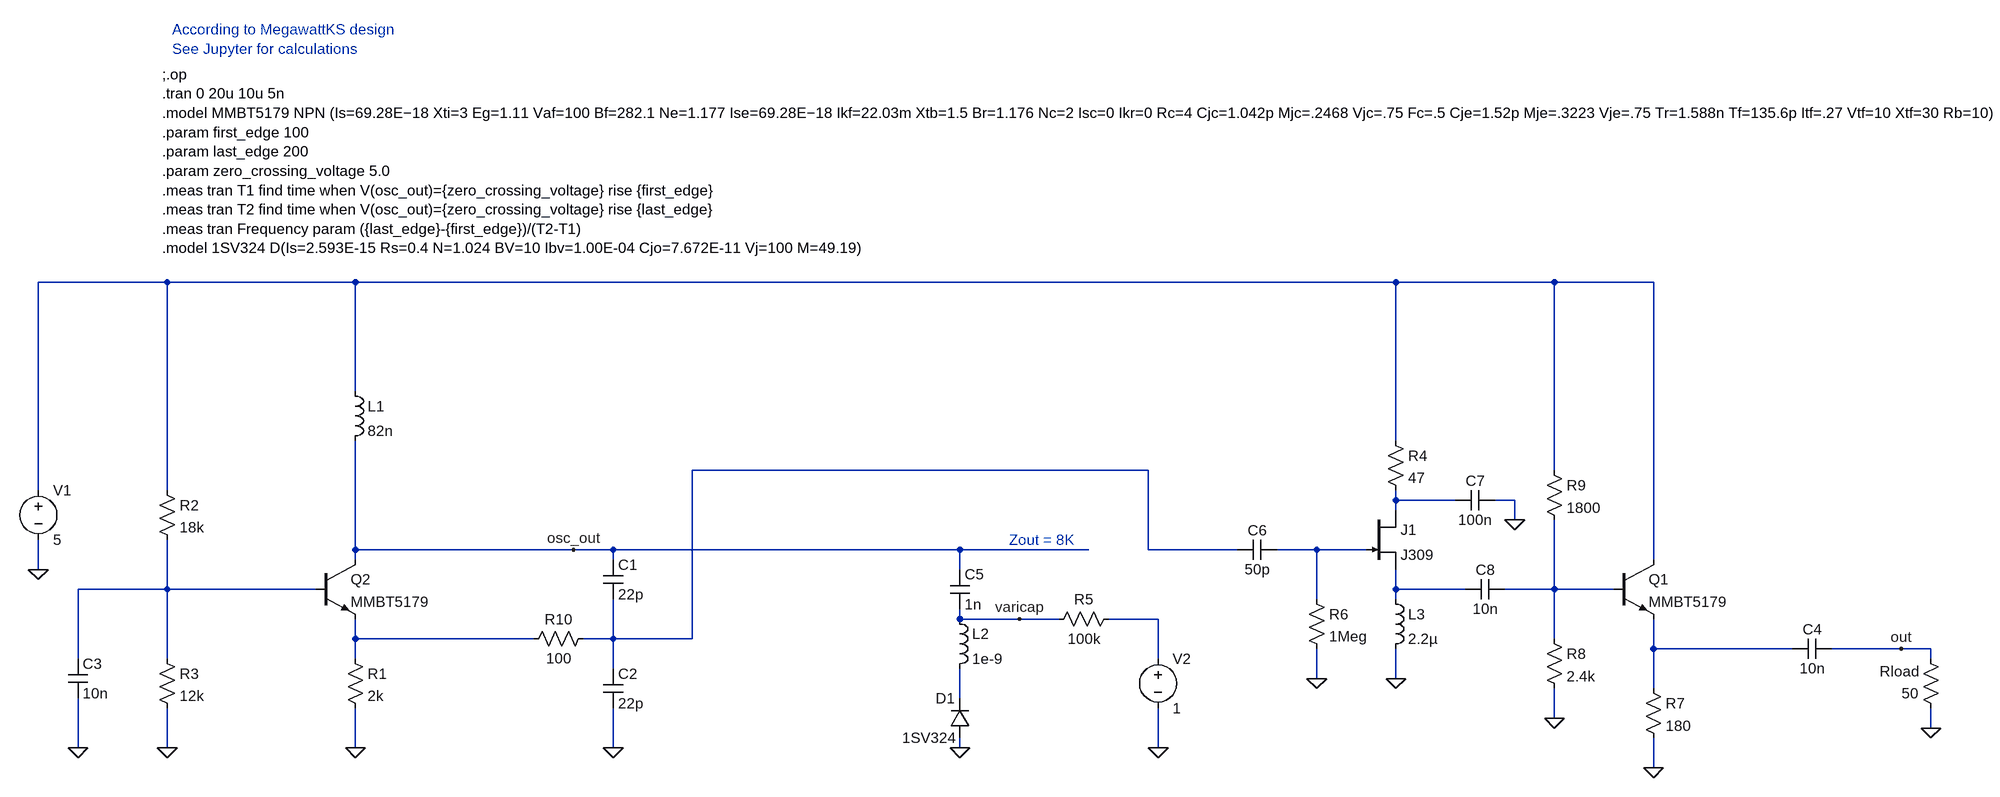
[diagram p0: schematic CB_Colpitts_JFET.asc]
CB_Colpitts_JFET.asc, the LTspice schematic file:
Version 4
SHEET 1 3300 1348
WIRE 48 -192 -160 -192
WIRE 352 -192 48 -192
WIRE 2032 -192 352 -192
WIRE 2288 -192 2032 -192
WIRE 2448 -192 2288 -192
WIRE 352 -16 352 -192
WIRE 2032 64 2032 -192
WIRE 1632 112 896 112
WIRE 2288 112 2288 -192
WIRE -160 144 -160 -192
WIRE 48 144 48 -192
WIRE 2032 160 2032 144
WIRE 2128 160 2032 160
WIRE 2224 160 2192 160
WIRE 2032 176 2032 160
WIRE 2224 192 2224 160
WIRE 352 240 352 64
WIRE 704 240 352 240
WIRE 768 240 704 240
WIRE 1328 240 768 240
WIRE 1536 240 1328 240
WIRE 1632 240 1632 112
WIRE 1776 240 1632 240
WIRE 1904 240 1840 240
WIRE 1984 240 1904 240
WIRE 352 256 352 240
WIRE 768 256 768 240
WIRE 2448 256 2448 -192
WIRE -160 272 -160 224
WIRE 1328 272 1328 240
WIRE 48 304 48 224
WIRE 48 304 -96 304
WIRE 288 304 48 304
WIRE 2032 304 2032 272
WIRE 2144 304 2032 304
WIRE 2288 304 2288 192
WIRE 2288 304 2208 304
WIRE 2384 304 2288 304
WIRE 1904 320 1904 240
WIRE 2032 320 2032 304
WIRE 1328 352 1328 336
WIRE 1424 352 1328 352
WIRE 1488 352 1424 352
WIRE 1648 352 1568 352
WIRE 352 384 352 352
WIRE 640 384 352 384
WIRE 768 384 768 320
WIRE 768 384 720 384
WIRE 896 384 896 112
WIRE 896 384 768 384
WIRE 2288 384 2288 304
WIRE 2448 400 2448 352
WIRE 2672 400 2448 400
WIRE 2848 400 2736 400
WIRE 2896 400 2848 400
WIRE -96 416 -96 304
WIRE 48 416 48 304
WIRE 352 416 352 384
WIRE 1648 416 1648 352
WIRE 2896 416 2896 400
WIRE 768 432 768 384
WIRE 1904 448 1904 400
WIRE 2032 448 2032 400
WIRE 2448 464 2448 400
WIRE 1328 480 1328 432
WIRE 2288 512 2288 464
WIRE 2896 528 2896 496
WIRE -96 560 -96 480
WIRE 48 560 48 496
WIRE 352 560 352 496
WIRE 768 560 768 496
WIRE 1328 560 1328 544
WIRE 1648 560 1648 496
WIRE 2448 592 2448 544
FLAG -160 272 0
FLAG 48 560 0
FLAG 352 560 0
FLAG 768 560 0
FLAG -96 560 0
FLAG 704 240 osc_out
FLAG 1648 560 0
FLAG 2896 528 0
FLAG 2848 400 out
FLAG 1328 560 0
FLAG 1424 352 varicap
FLAG 2224 192 0
FLAG 2032 448 0
FLAG 1904 448 0
FLAG 2448 592 0
FLAG 2288 512 0
DATAFLAG 144 304 ""
DATAFLAG 1216 240 ""
DATAFLAG 464 384 ""
DATAFLAG 1728 240 ""
SYMBOL npn 288 256 R0
SYMATTR InstName Q2
SYMATTR Value MMBT5179
SYMBOL res 336 400 R0
SYMATTR InstName R1
SYMATTR Value 2k
SYMBOL res 32 128 R0
SYMATTR InstName R2
SYMATTR Value 18k
SYMBOL res 32 400 R0
SYMATTR InstName R3
SYMATTR Value 12k
SYMBOL voltage -160 128 R0
SYMATTR InstName V1
SYMATTR Value 5
SYMBOL ind 336 -32 R0
SYMATTR InstName L1
SYMATTR Value 82n
SYMATTR SpiceLine Rser=0.01
SYMBOL cap 752 256 R0
SYMATTR InstName C1
SYMATTR Value 22p
SYMBOL cap 752 432 R0
SYMATTR InstName C2
SYMATTR Value 22p
SYMBOL cap -112 416 R0
SYMATTR InstName C3
SYMATTR Value 10n
SYMBOL res 1584 336 R90
WINDOW 0 0 56 VBottom 2
WINDOW 3 32 56 VTop 2
SYMATTR InstName R5
SYMATTR Value 100k
SYMBOL voltage 1648 400 R0
SYMATTR InstName V2
SYMATTR Value 1
SYMBOL diode 1344 544 R180
WINDOW 0 24 64 Left 2
WINDOW 3 24 0 Left 2
SYMATTR InstName D1
SYMATTR Value 1SV324
SYMBOL ind 1312 336 R0
SYMATTR InstName L2
SYMATTR Value 1e-9
SYMBOL res 2912 512 R180
WINDOW 0 36 76 Left 2
WINDOW 3 36 40 Left 2
SYMATTR InstName Rload
SYMATTR Value 50
SYMBOL cap 2736 384 R90
WINDOW 0 0 32 VBottom 2
WINDOW 3 32 32 VTop 2
SYMATTR InstName C4
SYMATTR Value 10n
SYMBOL res 736 368 R90
WINDOW 0 0 56 VBottom 2
WINDOW 3 32 56 VTop 2
SYMATTR InstName R10
SYMATTR Value 100
SYMBOL cap 1312 272 R0
SYMATTR InstName C5
SYMATTR Value 1n
SYMBOL njf 1984 176 R0
SYMATTR InstName J1
SYMATTR Value J309
SYMBOL res 2016 48 R0
SYMATTR InstName R4
SYMATTR Value 47
SYMBOL cap 2192 144 R90
WINDOW 0 0 32 VBottom 2
WINDOW 3 32 32 VTop 2
SYMATTR InstName C7
SYMATTR Value 100n
SYMBOL ind 2016 304 R0
SYMATTR InstName L3
SYMATTR Value 2.2µ
SYMBOL res 1888 304 R0
SYMATTR InstName R6
SYMATTR Value 1Meg
SYMBOL npn 2384 256 R0
SYMATTR InstName Q1
SYMATTR Value MMBT5179
SYMBOL res 2432 448 R0
SYMATTR InstName R7
SYMATTR Value 180
SYMBOL cap 2208 288 R90
WINDOW 0 0 32 VBottom 2
WINDOW 3 32 32 VTop 2
SYMATTR InstName C8
SYMATTR Value 10n
SYMBOL res 2272 368 R0
SYMATTR InstName R8
SYMATTR Value 2.4k
SYMBOL res 2272 96 R0
SYMATTR InstName R9
SYMATTR Value 1800
SYMBOL cap 1840 224 R90
WINDOW 0 0 32 VBottom 2
WINDOW 3 32 32 VTop 2
SYMATTR InstName C6
SYMATTR Value 50p
TEXT 40 -528 Left 2 !;.op\n.tran 0 20u 10u 5n\n.model MMBT5179 NPN (Is=69.28E−18 Xti=3 Eg=1.11 Vaf=100 Bf=282.1 Ne=1.177 Ise=69.28E−18 Ikf=22.03m Xtb=1.5 Br=1.176 Nc=2 Isc=0 Ikr=0 Rc=4 Cjc=1.042p Mjc=.2468 Vjc=.75 Fc=.5 Cje=1.52p Mje=.3223 Vje=.75 Tr=1.588n Tf=135.6p Itf=.27 Vtf=10 Xtf=30 Rb=10)\n.param first_edge 100\n.param last_edge 200\n.param zero_crossing_voltage 5.0\n.meas tran T1 find time when V(osc_out)={zero_crossing_voltage} rise {first_edge}\n.meas tran T2 find time when V(osc_out)={zero_crossing_voltage} rise {last_edge}\n.meas tran Frequency param ({last_edge}-{first_edge})/(T2-T1)\n.model 1SV324 D(Is=2.593E-15 Rs=0.4 N=1.024 BV=10 Ibv=1.00E-04 Cjo=7.672E-11 Vj=100 M=49.19)
TEXT 56 -600 Left 2 ;According to MegawattKS design\nSee Jupyter for calculations
TEXT 1408 224 Left 2 ;Zout = 8K

The netlist it stands for:
* CB_Colpitts_JFET.asc
Q2 osc_out N005 N009 0 MMBT5179
R1 N009 0 2k
R2 N001 N005 18k
R3 N005 0 12k
V1 N001 0 5
L1 N001 osc_out 82n Rser=0.01
C1 osc_out N002 22p
C2 N002 0 22p
C3 N005 0 10n
R5 N008 varicap 100k
V2 N008 0 1
D1 0 N011 1SV324
L2 varicap N011 1e-9
Rload 0 out 50
C4 out N010 10n
R10 N002 N009 100
C5 osc_out varicap 1n
J1 N003 N004 N006 J309
R4 N001 N003 47
C7 0 N003 100n
L3 N006 0 2.2µ
R6 N004 0 1Meg
Q1 N001 N007 N010 0 MMBT5179
R7 N010 0 180
C8 N007 N006 10n
R8 N007 0 2.4k
R9 N001 N007 1800
C6 N004 N002 50p
.model D D
.lib standard.dio
.model NPN NPN
.model PNP PNP
.lib standard.bjt
.model NJF NJF
.model PJF PJF
.lib standard.jft
;.op
.tran 0 20u 10u 5n
.model MMBT5179 NPN (Is=69.28E−18 Xti=3 Eg=1.11 Vaf=100 Bf=282.1 Ne=1.177 Ise=69.28E−18 Ikf=22.03m Xtb=1.5 Br=1.176 Nc=2 Isc=0 Ikr=0 Rc=4 Cjc=1.042p Mjc=.2468 Vjc=.75 Fc=.5 Cje=1.52p Mje=.3223 Vje=.75 Tr=1.588n Tf=135.6p Itf=.27 Vtf=10 Xtf=30 Rb=10)
.param first_edge 100
.param last_edge 200
.param zero_crossing_voltage 5.0
.meas tran T1 find time when V(osc_out)={zero_crossing_voltage} rise {first_edge}
.meas tran T2 find time when V(osc_out)={zero_crossing_voltage} rise {last_edge}
.meas tran Frequency param ({last_edge}-{first_edge})/(T2-T1)
.model 1SV324 D(Is=2.593E-15 Rs=0.4 N=1.024 BV=10 Ibv=1.00E-04 Cjo=7.672E-11 Vj=100 M=49.19)
* According to MegawattKS design
* See Jupyter for calculations
* Zout = 8K
.backanno
.end